# EAGLE design ultrasonic (EAGLE 9.6.2)
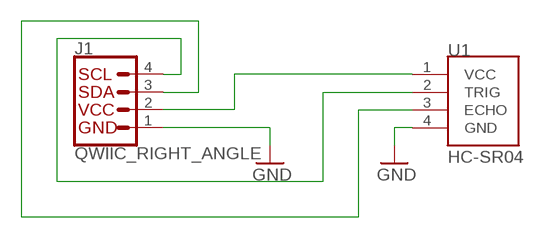
[diagram p0: schematic, sheet 1]

## Parts
J1  QWIIC_RIGHT_ANGLE  QWIIC_CONNECTORJS-1MM  [JST04_1MM_RA]
U1  HC-SR04  [XCVR_HC-SR04]

## Nets
GND: J1.1 U1.4(GND)
N$1: J1.3 U1.3(ECHO)
N$2: J1.2 U1.1(VCC)
N$3: J1.4 U1.2(TRIG)

## Library data of the parts
J1 = SparkFun-Connectors:QWIIC_CONNECTOR: SparkFun I2C Standard Qwiic Connector An SMD 1mm pitch JST connector makes it easy and quick (get it? Qwiic?) to connect I2C devices to each other. The Qwiic system <http://www.sparkfun.com/qwiic> enables fast and solderless connection between popular platforms and various sensors and actuators. We carry 200mm <https://www.sparkfun.com/products/14204>, 100mm <https://www.sparkfun.com/products/14205>, 50mm <https://www.sparkfun.com/products/14206>, and breadboard friendly <https://www.sparkfun.com/products/14207> Qwiic cables. We also offer 10 pcs strips <https://www.sparkfun.com/products/14323> the SMD connectors.; PROD_ID: CONN-13694
U1 = HC-SR04:HC-SR04: Ultrasonic Sensor Module Check availability <https://pricing.snapeda.com/parts/HC-SR04/SparkFun%20Electronics/view-part?ref=eda>; AVAILABILITY: In Stock; DESCRIPTION: HC-SR04 Ultrasonic Sensor Qwiic Platform Evaluation Expansion Board; MF: SparkFun Electronics; MP: HC-SR04; PACKAGE: None; PRICE: None; PURCHASE-URL: https://pricing.snapeda.com/search/part/HC-SR04/?ref=eda

## Board
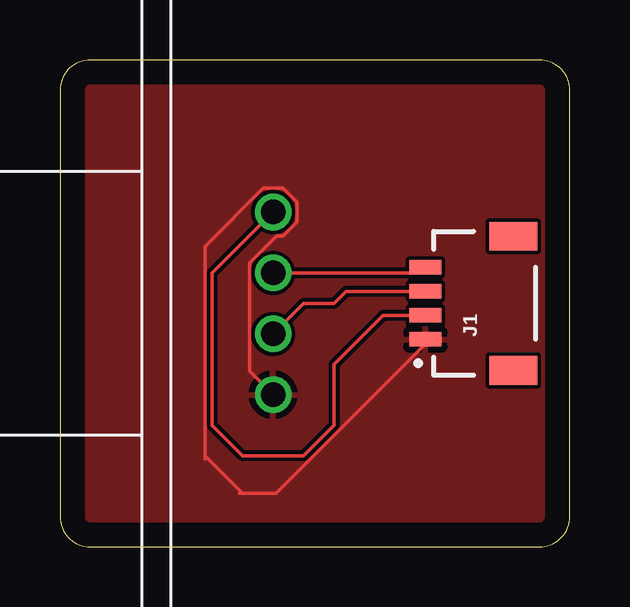
[diagram p1: board, top side]

Size 21.26 x 20.31 mm. Coordinates in mm from the lower left corner, seen from the top.
Outline: 0,19.04 0,1.27 arc90 1.27,0 19.99,0 arc90 21.26,1.27 21.26,19.04 arc90 19.99,20.31 1.27,20.31 arc90 0,19.04
Copper layers (1*16): Top 0.035mm / dielectric 1.5mm / Bottom 0.035mm
Design rules "default": minimum track width 6mil, minimum drill 0.35mm, track to track 6mil, track to pad 6mil, pad to pad 6mil, via to via 6mil, smd to smd 6mil, copper to edge 40mil, drill to drill 6mil, minimum pad ring 10mil, minimum via ring 8mil, stop-mask expansion 4mil, vias tented up to drill 0mil, thermal gap 10mil

### Footprints (pad centres in the part's own frame; a part is rotated, then mirrored left to right if it is on the bottom)
JST04_1MM_RA = smd 0.6 x 1.35: 1 -1.5,0; 2 -0.5,0; 3 0.5,0; 4 1.5,0 | smd 1.2 x 2: NC1 2.8,-3.675; NC2 -2.8,-3.675
XCVR_HC-SR04 = drill 1.02: 1 -3.81,0; 2 -1.27,0; 3 1.27,0; 4 3.81,0

### Placement (x,y rotation side)
J1  15.24,10.16 90 top
U1  8.89,10.16 270 top

### Tracks (layer width: path | path; a pad name or v marks a point on that pad's centre or on a via)
GND
  Top 0.152: J1.1 15.24,8.46 9.02,2.23 7.62,2.23 | 7.49,2.23 7.62,2.23 | 6.05,3.81 6.05,12.53 8.48,14.96 9.3,14.96 9.88,14.38 9.88,13.56 9.3,12.98 9.03,12.98 7.9,11.84 7.9,7.34 U1.4 | 6.05,3.81 6.05,3.68 | 7.62,2.23 6.05,3.81
  pour Top: 0,1.27 0,19.05 arc-90 1.27,20.32 20.32,20.32 arc-90 21.59,19.05 21.59,1.27 arc-90 20.32,0 1.27,0 arc-90
N$1
  Top 0.152: U1.3 10.16,10.16 11.43,10.16 11.93,10.66 J1.3
N$2
  Top 0.152: 14.74,9.66 J1.2 13.47,9.66 11.43,7.62 11.43,5.08 10.16,3.81 7.62,3.81 6.35,5.08 6.35,11.43 U1.1
N$3
  Top 0.152: J1.4 15.24,11.43 U1.2